# EAGLE board BMS Master Teensy V 2.22 move 4G (EAGLE 7.2.0), part 1 of 2
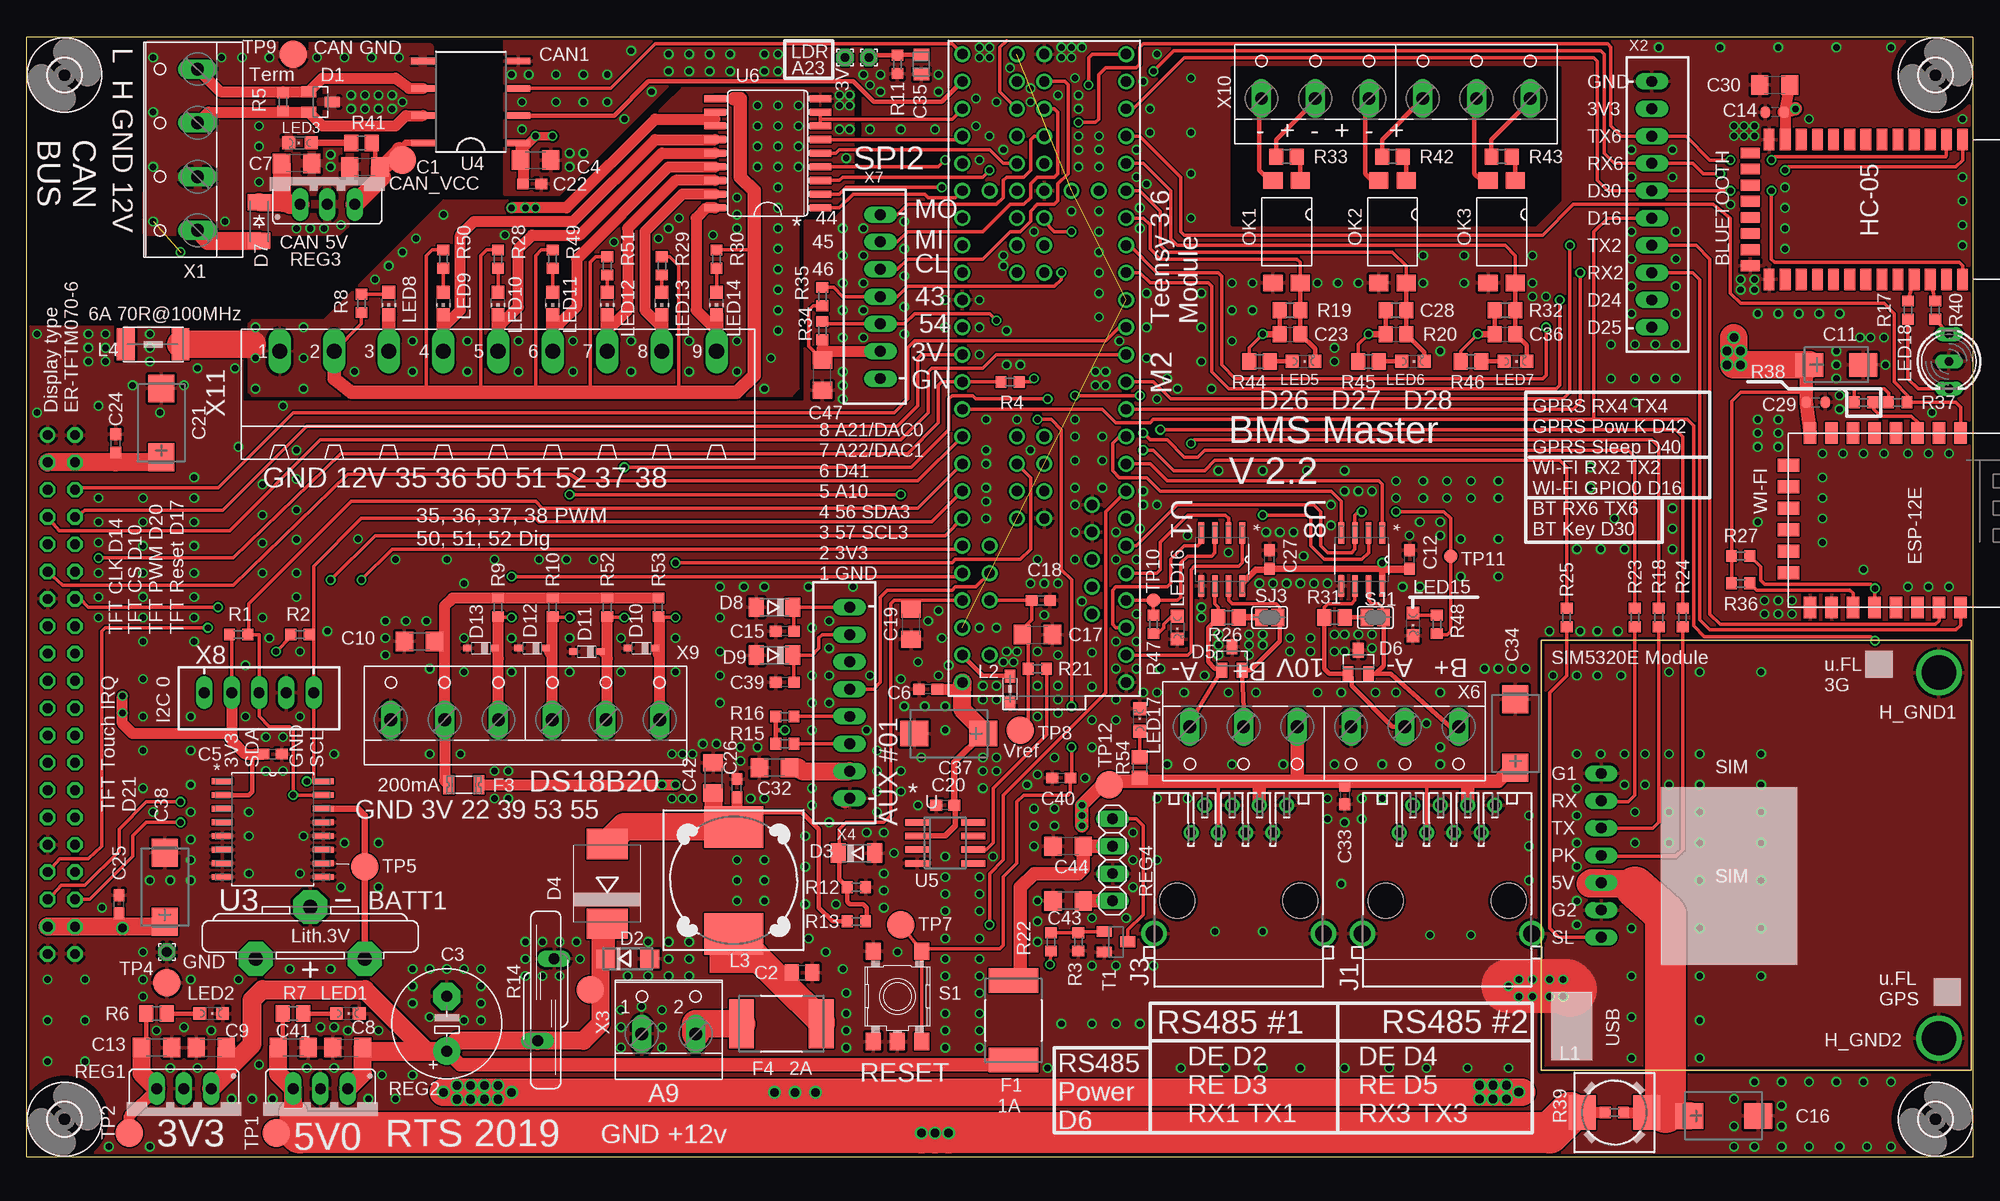
[diagram p3: board, top side]
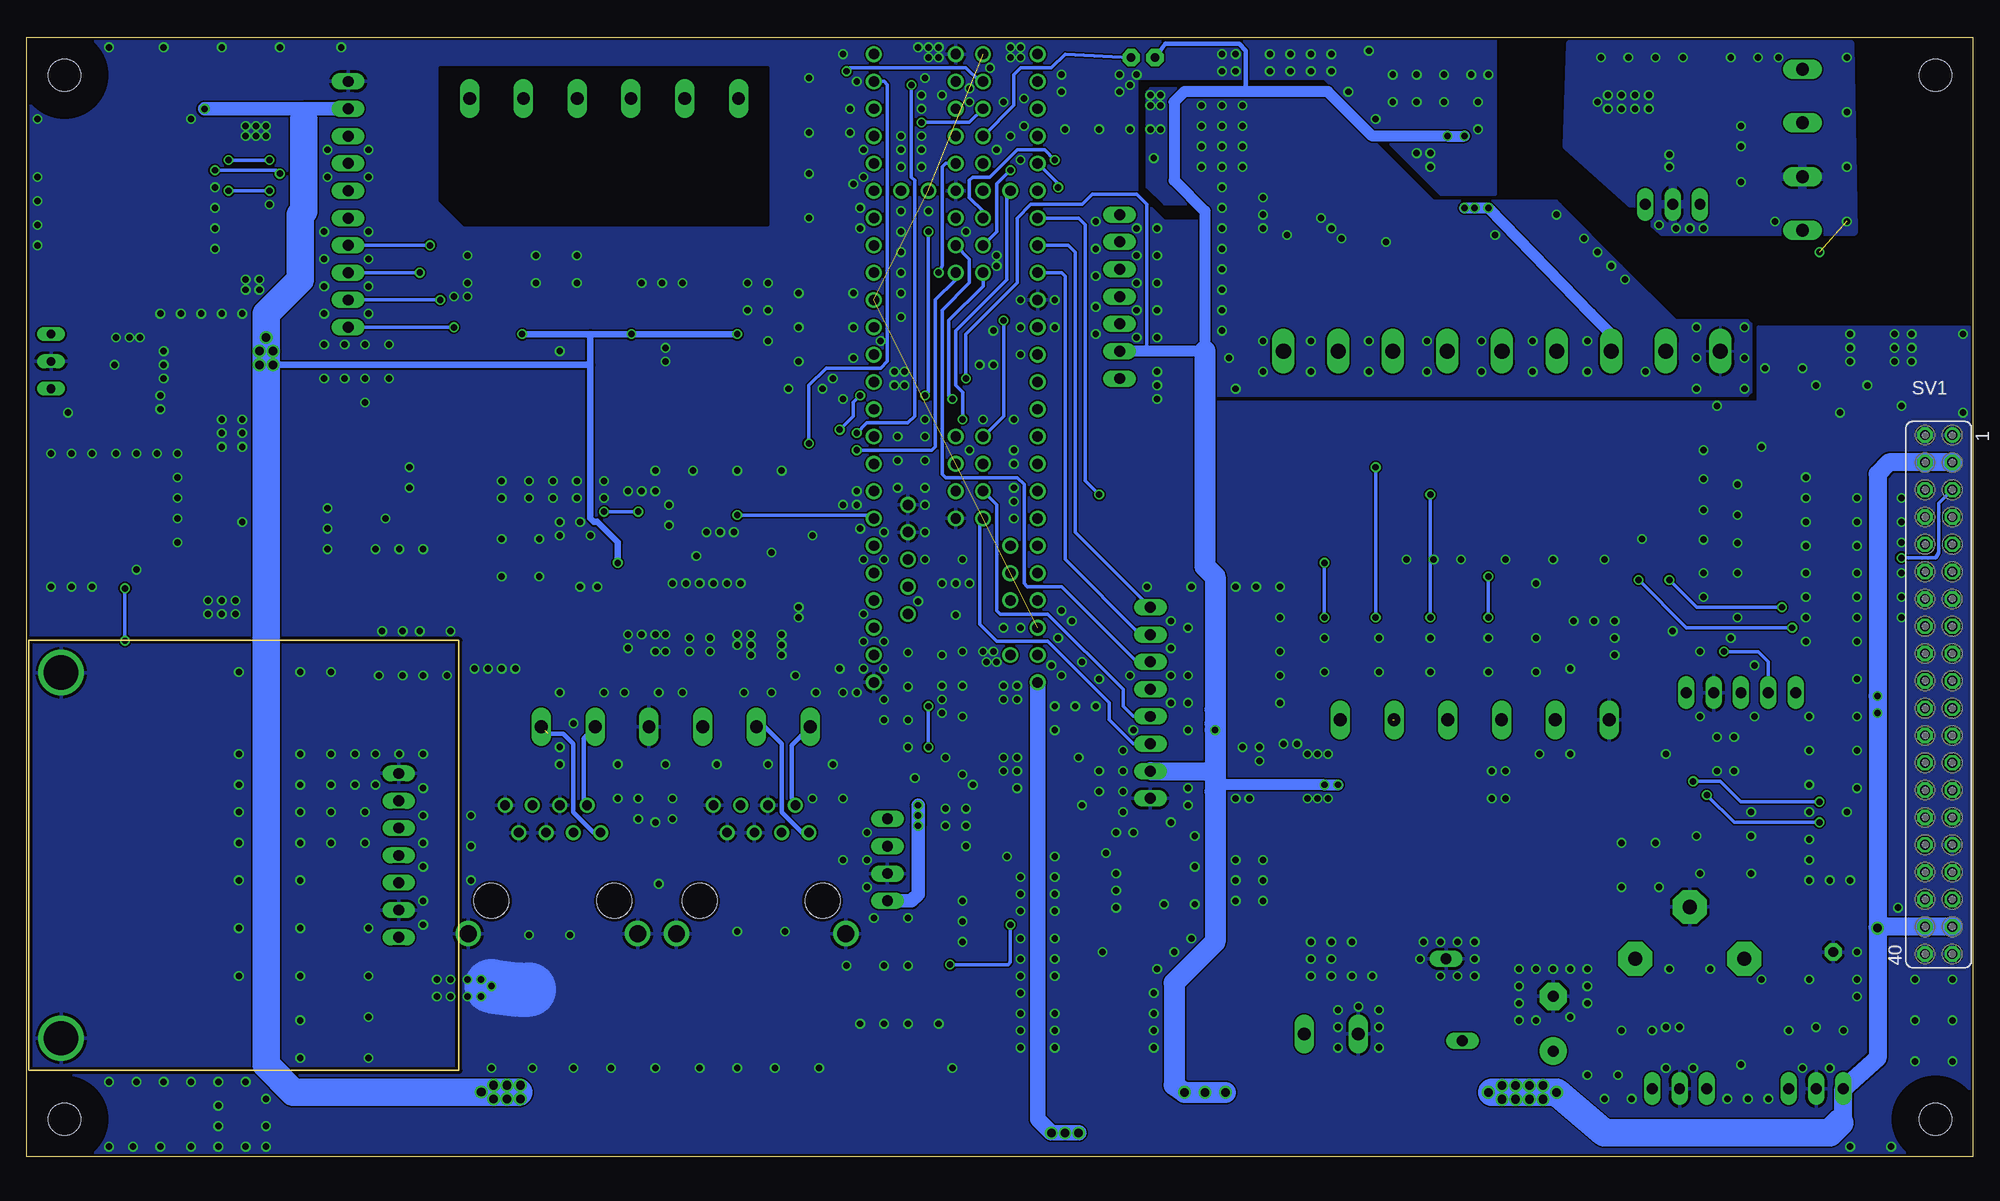
[diagram p4: board, bottom side, seen from below]

Size 181 x 104.14 mm. Coordinates in mm from the lower left corner, seen from the top.
Outline: 181,104.14 181,0 0,0 0,104.14 180.97,104.14
Copper layers (1*16): Top 0.035mm / dielectric 1.5mm / Bottom 0.035mm
Design rules "SeeedStudio_2layer_DRU_no_angle_20140221": minimum track width 6mil, minimum drill 12mil, track to track 6mil, track to pad 6mil, pad to pad 6mil, via to via 6mil, smd to smd 0mil, copper to edge 10mil, drill to drill 10mil, minimum pad ring 10mil, minimum via ring 6mil, stop-mask expansion 2mil, vias tented up to drill 100mil, thermal gap 10mil
Net classes: 1 power: width 0.152 mm, drill 0.61 mm, clearance 0.229 mm; 2 RS485 Differential: width 0.076 mm, drill 0.229 mm, clearance 0.229 mm
tRestrict: area 112.1,86.7 to 142.6,101.3
bRestrict: area 112.1,86.7 to 142.6,101.3

## Footprints (pad centres in the part's own frame; a part is rotated, then mirrored left to right if it is on the bottom)
1,6/0,8 = drill 0.813 pad 1.6 octagon: 1 0,0
CR2032V = drill 1.321 pad 3.15 octagon: + -2.54,-5.08; +@1 -2.54,5.08; - 2.286,0
BLUETOOTH_SMD = smd 2 x 1: 1 0,0; 2 0,-1.5; 3 0,-3; 4 0,-4.5; 5 0,-6; 6 0,-7.5; 7 0,-9; 8 0,-10.5; 9 0,-12; 10 0,-13.5; 11 0,-15; 12 0,-16.5; 13 0,-18; 22 13,-18; 23 13,-16.5; 24 13,-15; 25 13,-13.5; 26 13,-12; 27 13,-10.5; 28 13,-9; 29 13,-7.5; 30 13,-6; 31 13,-4.5; 32 13,-3; 33 13,-1.5; 34 13,0 | smd 1 x 1.8: 14 1.25,-19.75; 15 2.75,-19.75; 16 4.25,-19.75; 17 5.75,-19.75; 18 7.25,-19.75; 19 8.75,-19.75; 20 10.25,-19.75; 21 11.75,-19.75
C1206 = smd 1.6 x 1.8: 1 -1.4,0; 2 1.4,0
C0805 = smd 1.3 x 1.5: 1 -0.95,0; 2 0.95,0
E5-10,5 = drill 1.016 pad 2.54: + -2.54,0 | drill 1.016 pad 2.54 octagon: - 2.54,0
C0603 = smd 1.1 x 1: 1 -0.85,0; 2 0.85,0
CT6032 = smd 2.6 x 2.2: + -2.5,0; - 2.5,0
C0603-ROUND = smd 0.898 x 1.1: 1 -0.889,0; 2 0.889,0
CT7343 = smd 2.6 x 2.4: + -3.2,0; - 3.2,0
CAPC2012X140N = smd 1.118 x 1.448: 1 -0.914,0; 2 0.914,0
B2,54 = smd 2.54 x 2.54: TP 0,0
SOT23 = smd 1 x 1.4: 1 -0.95,-1.1; 2 0.95,-1.1; 3 0,1.1
DO214AC = smd 1.8 x 1.7: A 2.05,0; C -2.05,0
SOD80C = smd 1.4 x 1.8: A 1.7,0; C -1.7,0
SMC = smd 2.8 x 3.8: A 3.7,0; C -3.7,0
SOD-123_MINI-SMA = smd 1.5 x 2.1: A 1.8,0; C -1.8,0
SOD323_ST = smd 0.8 x 0.6: A 1.25,0; C -1.25,0
SMD050F = smd 2.3 x 4.6: 1 -3.7,0; 2 3.7,0
1206L = smd 1 x 1.8: 1 -1.4,0; 2 1.4,0
1,6/0,9 = drill 0.914 pad 1.6 octagon: 1 0,0
555153-1 = drill 0.889: 1 -4.445,6.35; 2 -3.175,8.89; 3 -1.905,6.35; 4 -0.635,8.89; 5 0.635,6.35; 6 1.905,8.89; 7 3.175,6.35; 8 4.445,8.89 | drill 1.575 pad 2.184: G1 -7.874,-3.048; G2 7.874,-3.048 | hole 3.251: -5.715,0; 5.715,0
DR73 = smd 2.5 x 3.25: 1 -3,0; 2 3,0
0805 = smd 1.2 x 1: 1 -1.2,0; 2 1.2,0
DR127 = smd 3.85 x 5.5: 1 -4.975,0; 2 4.975,0
1812 = smd 1.65 x 3: 1 -2.55,0; 2 2.55,0
CHIPLED_0805 = smd 1.2 x 1.2: A 0,-1.05; C 0,1.05
CHIP-LED0805 = smd 1.2 x 1.2: A 0,-1.05; C 0,1.05
DUOLED-C-5MM = drill 0.813 long: AR 2.54,0; AX -2.54,0; C 0,0
SIM5320E_MODULE = drill 1 long: GND_1 -14.4,7.62; GND_2 -14.4,-5.08; POWKEY -14.4,0; RX -14.4,5.08; SLEEP -14.4,-7.62; TX -14.4,2.54; VCC_5V -14.4,-2.54 | drill 3.2: H_GND1 17,17; H_GND2 17,-17
TEENSY_3.6_ALL_PINS&PADS = drill 0.965: 0 -7.62,26.67; 1 -7.62,24.13; 2 -7.62,21.59; 3 -7.62,19.05; 3.3V 7.62,24.13; 3.3V2 2.54,-29.21; 3.3V3 -7.62,-6.35; 3.3V4 -2.54,-16.51; 4 -7.62,16.51; 5 -7.62,13.97; 6 -7.62,11.43; 7 -7.62,8.89; 8 -7.62,6.35; 9 -7.62,3.81; 10 -7.62,1.27; 11 -7.62,-1.27; 12 -7.62,-3.81; 13 7.62,-3.81; 14/A0 7.62,-1.27; 15/A1 7.62,1.27; 16/A2 7.62,3.81; 17/A3 7.62,6.35; 18/A4 7.62,8.89; 19/A5 7.62,11.43; 20/A6 7.62,13.97; 21/A7 7.62,16.51; 22/A8 7.62,19.05; 23/A9 7.62,21.59; 24 -7.62,-8.89; 25 -7.62,-11.43; 26 -7.62,-13.97; 27 -7.62,-16.51; 28 -7.62,-19.05; 29 -7.62,-21.59; 30 -7.62,-24.13; 31/A12 -7.62,-26.67; 32/A13 -7.62,-29.21; 33/A14 7.62,-29.21; 34/A15 7.62,-26.67; 35/A16 7.62,-24.13; 36/A17 7.62,-21.59; 37/A18 7.62,-19.05; 38/A19 7.62,-16.51; 39/A20 7.62,-13.97; 40 0,-8.89; 41 0,-11.43; 42 0,-13.97; 43 0,-19.05; 44 0,-21.59; 45 0,-24.13; 46 0,-26.67; 47 2.54,-26.67; 48 2.54,-24.13; 49 2.54,-21.59; 50 2.54,-19.05; 51 2.54,-13.97; 52 2.54,-11.43; 53 2.54,-8.89; 54 2.54,6.35; 55 2.54,8.89; 56 2.54,11.43; 57 2.54,13.97; A10 5.08,19.05; A11 5.08,16.51; A21 7.62,-11.43; A22 7.62,-8.89; AGND 7.62,26.67; AREF 5.08,21.59; D+ -4.445,17.78; D- -4.445,20.32; DC 0,8.89; DE 0,11.43; DO 0,6.35; GND -7.62,29.21; GND1 7.62,-6.35; GND2 0,13.97; GND3 -4.445,15.24; GND4 -4.445,12.7; GND5 0,-29.21; GND6 0,-16.51; PGM 2.54,-16.51; RESET 5.08,-16.51; VBAT -5.08,-16.51; VIN 7.62,29.21; VUSB 5.08,26.67; VUSB1 -4.445,22.86
SMD4-7 = smd 1.78 x 1.55: 1 -1.27,-4.77; 2 1.27,-4.77; 3 1.27,4.77; 4 -1.27,4.77
R0603 = smd 1 x 1.1: 1 -0.85,0; 2 0.85,0
R0805 = smd 1.3 x 1.5: 1 -0.95,0; 2 0.95,0
S14K11 = drill 1.016 long: 1 -0.762,-3.81; 2 0.762,3.81
78XXS = drill 1.016 long: GND 0,-2.54; IN -2.54,-2.54; OUT 2.54,-2.54
1X04 = drill 1.016 long: 1 -3.81,0; 2 -1.27,0; 3 1.27,0; 4 3.81,0
SKHMPXE010 = smd 1.6 x 1.4: 1 -4.2,2.25; 2 4.2,2.25; 3 -4.2,-2.25; 4 4.2,-2.25; 5 4.2,0
SJ = smd 1.168 x 1.6: 1 -0.762,0; 2 0.762,0
FE20-2 = drill 0.914: 1 -24.13,1.27 | drill 0.914 octagon: 2 -24.13,-1.27; 3 -21.59,1.27; 4 -21.59,-1.27; 5 -19.05,1.27; 6 -19.05,-1.27; 7 -16.51,1.27; 8 -16.51,-1.27; 9 -13.97,1.27; 10 -13.97,-1.27; 11 -11.43,1.27; 12 -11.43,-1.27; 13 -8.89,1.27; 14 -8.89,-1.27; 15 -6.35,1.27; 16 -6.35,-1.27; 17 -3.81,1.27; 18 -3.81,-1.27; 19 -1.27,1.27; 20 -1.27,-1.27; 21 1.27,1.27; 22 1.27,-1.27; 23 3.81,1.27; 24 3.81,-1.27; 25 6.35,1.27; 26 6.35,-1.27; 27 8.89,1.27; 28 8.89,-1.27; 29 11.43,1.27; 30 11.43,-1.27; 31 13.97,1.27; 32 13.97,-1.27; 33 16.51,1.27; 34 16.51,-1.27; 35 19.05,1.27; 36 19.05,-1.27; 37 21.59,1.27; 38 21.59,-1.27; 39 24.13,1.27; 40 24.13,-1.27
B1,27 = smd 1.27 x 1.27: TP 0,0
SOIC127P600X175-8N = smd 1.981 x 0.533: 1 -2.464,1.905; 2 -2.464,0.635; 3 -2.464,-0.635; 4 -2.464,-1.905; 5 2.464,-1.905; 6 2.464,-0.635; 7 2.464,0.635; 8 2.464,1.905
SOIC127P1032X265-16N = smd 1.981 x 0.533: 1 -4.699,4.445; 2 -4.699,3.175; 3 -4.699,1.905; 4 -4.699,0.635; 5 -4.699,-0.635; 6 -4.699,-1.905; 7 -4.699,-3.175; 8 -4.699,-4.445; 9 4.699,-4.445; 10 4.699,-3.175; 11 4.699,-1.905; 12 4.699,-0.635; 13 4.699,0.635; 14 4.699,1.905; 15 4.699,3.175; 16 4.699,4.445
DUB-R-PDSO-G8 = smd 0.6 x 2.2: 1 -3.81,-4.445; 2 -1.27,-4.445; 3 1.27,-4.445; 4 3.81,-4.445; 5 3.81,4.445; 6 1.27,4.445; 7 -1.27,4.445; 8 -3.81,4.445
MAX6177AASA+ = smd 0.6 x 2.2: 1 -1.905,-2.6; 2 -0.635,-2.6; 3 0.635,-2.6; 4 1.905,-2.6; 5 1.905,2.6; 6 0.635,2.6; 7 -0.635,2.6; 8 -1.905,2.6
SO18L = smd 0.66 x 2.032: 1 -5.08,-4.902; 2 -3.81,-4.902; 3 -2.54,-4.902; 4 -1.27,-4.902; 5 0,-4.902; 6 1.27,-4.902; 7 2.54,-4.902; 8 3.81,-4.902; 9 5.08,-4.902; 10 5.08,4.902; 11 3.81,4.902; 12 2.54,4.902; 13 1.27,4.902; 14 0,4.902; 15 -1.27,4.902; 16 -2.54,4.902; 17 -3.81,4.902; 18 -5.08,4.902
3,0 = hole 3: 0,0
ESP8266-ESP12E = smd 2 x 1.2: 1 -7.62,5.84; 2 -7.62,3.84; 3 -7.62,1.84; 4 -7.62,-0.16; 5 -7.62,-2.16; 6 -7.62,-4.16; 7 -7.62,-6.16; 8 -7.62,-8.16; 9 8.58,-8.16; 10 8.58,-6.16; 11 8.58,-4.16; 12 8.58,-2.16; 13 8.58,-0.16; 14 8.58,1.84; 15 8.58,3.84; 16 8.58,5.84 | smd 1.2 x 2: 17 -4.62,-10.16; 18 -2.62,-10.16; 19 -0.62,-10.16; 20 1.38,-10.16; 21 3.38,-10.16; 22 5.38,-10.16
W237-4 = drill 1.194 long: 1 -7.5,-1.27; 2 -2.5,-1.27; 3 2.5,-1.27; 4 7.5,-1.27
JST-XH-10-PACKAGE-LONG-PAD = drill 1.016 long: 1 -11.43,0; 2 -8.89,0; 3 -6.35,0; 4 -3.81,0; 5 -1.27,0; 6 1.27,0; 7 3.81,0; 8 6.35,0; 9 8.89,0; 10 11.43,0
W237-102 = drill 1.194 long: 1 -2.5,-1.27; 2 2.5,-1.27
JST-XH-08-PACKAGE-LONG-PAD = drill 1.016 long: 1 -8.89,0; 2 -6.35,0; 3 -3.81,0; 4 -1.27,0; 5 1.27,0; 6 3.81,0; 7 6.35,0; 8 8.89,0
W237-6 = drill 1.194 long: 1 -12.5,-1.27; 2 -7.5,-1.27; 3 -2.5,-1.27; 4 2.5,-1.27; 5 7.5,-1.27; 6 12.5,-1.27
JST-XH-07-PACKAGE-LONG-PAD = drill 1.016 long: 1 -7.62,0; 2 -5.08,0; 3 -2.54,0; 4 0,0; 5 2.54,0; 6 5.08,0; 7 7.62,0
JST-XH-05-PACKAGE-LONG-PAD = drill 1.016 long: 1 -5.08,0; 2 -2.54,0; 3 0,0; 4 2.54,0; 5 5.08,0
MSTBA9 = drill 1.397 long: 1 -20.32,5.08; 2 -15.24,5.08; 3 -10.16,5.08; 4 -5.08,5.08; 5 0,5.08; 6 5.08,5.08; 7 10.16,5.08; 8 15.24,5.08; 9 20.32,5.08

## Placement (x,y rotation side)
3V  [1,6/0,8]  76.08,102.23 0 top
BATT1  CR2032V  [CR2032V]  26.35,20.95 90 top
BLUETOOTH  HC_05  [BLUETOOTH_SMD]  180.02,94.61 270 top
C1  10uF  [C1206]  31.43,92.08 0 top
C2  100nF 25V  [C0805]  72.07,17.14 0 top
C3  2200uF 25V  [E5-10,5]  39.05,12.38 90 top
C4  10uF 6V3  [C1206]  47.31,92.71 0 top
C5  100nF  [C0603]  22.86,37.47 0 top
C6  100nF  [C0603]  83.82,43.5 180 top
C7  10uF  [C1206]  25.08,92.39 180 top
C8  10uF 25v  [C1206]  29.84,10.16 0 top
C9  10uF 25v  [C1206]  17.14,10.16 0 top
C10  10uF  [C1206]  36.51,47.94 0 top
C11  100uF 6V3  [CT6032]  168.28,73.66 0 top
C12  100nF  [C0603]  128.59,55.56 90 top
C13  10uF 25v  [C1206]  12.06,10.16 180 top
C14  100n  [C0603-ROUND]  162.56,97.16 180 top
C15  100nF  [C0603]  70.48,48.9 180 top
C16  470uF 6v3  [CT7343]  157.8,3.81 0 top
C17  10uF 6V3  [C1206]  93.98,48.58 0 top
C18  100nF  [C0603]  94.3,51.75 0 top
C19  47uF 6V3  [C1206]  82.23,49.53 90 top
C20  100nF  [C0603]  85.41,32.7 180 top
C21  220uF 6v3  [CT7343]  12.5,68.26 90 top
C22  100nF  [C0603]  46.99,90.49 0 top
C23  100nF  [C0805]  117.47,76.52 0 top
C24  100nF  [C0603]  8.26,66.36 90 top
C25  100nF  [C0603]  8.57,23.5 90 top
C26  100nF 25v  [C0603]  66.04,34.29 90 top
C27  100nF  [C0603]  115.57,55.56 90 top
C28  100nF  [C0805]  127.32,76.52 0 top
C29  100n  [C0603-ROUND]  166.37,70.17 0 top
C30  10uF  [C1206]  162.56,99.69 0 top
C32  10uF 6V3  [C1206]  69.53,36.2 180 top
C33  100nF  [C0603]  122.56,33.66 270 top
C34  220uF 16V  [CT7343]  138.43,39.37 90 top
C35  10µF  [CAPC2012X140N]  83.19,101.6 90 top
C36  100nF  [C0805]  137.48,76.52 0 top
C37  220uF 6v3  [CT7343]  85.72,39.37 180 top
C38  220uF 6v3  [CT7343]  12.82,25.08 90 top
C39  100nF  [C0603]  70.48,44.13 180 top
C40  100pF NM  [C0603]  96.2,35.24 0 top
C41  10uF 25v  [C1206]  24.77,10.16 180 top
C42  10uF  [C1206]  63.82,35.24 270 top
C43  10uF 6V3  [C1206]  96.84,23.81 180 top
C44  10uF 6V3  [C1206]  96.84,28.89 180 top
C47  10uF  [C1206]  73.98,72.71 90 top
CAN_VCC  TPB2,54  [B2,54]  34.92,92.71 0 top
D1  PESD1CAN  [SOT23]  27.3,98.11 270 top
D2  SMBJ14A  [DO214AC]  55.88,18.41 0 top
D3  3V3  [SOD80C]  77.15,28.26 0 top
D4  [SMC]  53.98,25.4 90 top
D5  PESD1CAN  [SOT23]  112.08,46.35 0 top
D6  PESD1CAN  [SOT23]  123.83,46.04 0 top
D7  CGRM4001-G  [SOD-123_MINI-SMA]  21.59,87 270 top
D8  3V3  [SOD80C]  69.53,51.12 180 top
D9  3V3  [SOD80C]  69.53,46.67 180 top
D10  SOD-323_ZENER_DIODE  [SOD323_ST]  57.15,47.31 180 top
D11  SOD-323_ZENER_DIODE  [SOD323_ST]  52.07,46.99 180 top
D12  SOD-323_ZENER_DIODE  [SOD323_ST]  46.99,47.31 180 top
D13  SOD-323_ZENER_DIODE  [SOD323_ST]  42.23,47.31 180 top
F1  SMD100F  [SMD050F]  91.76,12.7 90 top
F3  1206L075TH  [1206L]  40.64,34.61 180 top
F4  SMD100F  [SMD050F]  70.17,12.38 0 top
GND  [1,6/0,9]  13.02,19.05 0 top
J1  [555153-1]  132.08,23.81 0 top
J3  [555153-1]  112.71,23.81 0 top
L1  DR73  [DR73]  147.64,4.13 180 top
L2  [0805]  91.44,43.5 270 top
L3  DR127  [DR127]  65.72,25.72 90 top
L4  [1812]  11.75,75.56 180 top
LDR  [1,6/0,8]  78.31,102.23 0 top
LED1  Green  [CHIPLED_0805]  29.84,13.34 270 top
LED2  Green  [CHIPLED_0805]  17.14,13.34 270 top
LED3  Green  [CHIPLED_0805]  25.4,94.3 90 top
LED5  Blue  [CHIPLED_0805]  118.75,73.98 270 top
LED6  Blue  [CHIPLED_0805]  128.91,73.98 270 top
LED7  Blue  [CHIPLED_0805]  138.43,73.98 270 top
LED8  Red  [CHIP-LED0805]  33.66,79.38 180 top
LED9  RED  [CHIP-LED0805]  38.73,79.38 180 top
LED10  WHITE  [CHIP-LED0805]  43.81,79.38 180 top
LED11  YELLOW  [CHIP-LED0805]  48.9,79.38 180 top
LED12  GREEN  [CHIP-LED0805]  53.98,79.38 180 top
LED13  BLUE  [CHIP-LED0805]  59.05,79.38 180 top
LED14  WHITE  [CHIP-LED0805]  64.14,79.38 180 top
LED15  Yellow  [CHIPLED_0805]  128.91,49.53 180 top
LED16  Yellow  [CHIPLED_0805]  107,49.21 180 top
LED17  Green  [CHIPLED_0805]  103.5,40.64 0 top
LED18  [DUOLED-C-5MM]  178.75,73.98 270 top
M1  [SIM5320E_MODULE]  160.82,28.04 0 top
M2  TEENSY_3.6_ALL_PINS&PADS  [TEENSY_3.6_ALL_PINS&PADS]  94.61,73.34 180 top
OK1  SFH6186-2  [SMD4-7]  117.16,86.04 180 top
OK2  SFH6186-2  [SMD4-7]  127,86.04 180 top
OK3  SFH6186-2  [SMD4-7]  137.16,86.04 180 top
R1  3K3  [R0603]  19.68,48.58 180 top
R2  3K3  [R0603]  25.4,48.58 180 top
R3  1M  [R0603]  97.79,20 270 top
R4  10K  [R0603]  91.44,72.07 0 top
R5  120R -OPTIONAL  [R0603]  23.81,98.11 90 top
R6  10K  [R0805]  12.06,13.34 180 top
R7  22K  [R0805]  24.77,13.34 180 top
R8  22K  [R0603]  31.11,79.38 90 top
R9  2K2  [R0603]  43.81,51.12 90 top
R10  2K2  [R0603]  48.9,51.12 90 top
R11  10K  [R0603]  80.96,101.6 270 top
R12  2K2  [R0603]  77.15,25.08 180 top
R13  10K  [R0603]  77.15,21.91 180 top
R14  S14K11  [S14K11]  48.26,14.61 180 top
R15  3K3  [R0603]  70.48,38.42 180 top
R16  3K3  [R0603]  70.48,40.96 180 top
R17  1K  [R0603]  174.94,78.74 90 top
R18  1K  [R0603]  151.76,50.16 270 top
R19  10K  [R0805]  117.47,78.74 180 top
R20  10K  [R0805]  127.32,78.74 180 top
R21  470R  [R0603]  93.98,45.4 0 top
R22  10K  [R0603]  95.25,20 90 top
R23  1K  [R0603]  149.54,50.16 270 top
R24  1K  [R0603]  153.99,50.16 270 top
R25  1K  [R0603]  143.19,50.16 90 top
R26  100R  [R0805]  111.76,50.16 180 top
R27  4K7  [R0603]  159.38,53.34 0 top
R28  22K  [R0603]  43.81,83.5 270 top
R29  22K  [R0603]  59.05,82.87 270 top
R30  22K  [R0603]  64.14,83.5 270 top
R31  100R  [R0805]  121.6,50.16 180 top
R32  10K  [R0805]  137.48,78.74 180 top
R33  2K2  [R0805]  117.16,93.03 180 top
R34  10K  [R0603]  73.98,76.83 270 top
R35  10K  [R0603]  73.98,80.01 270 top
R36  4K7  [R0603]  159.38,55.88 0 top
R37  4K7  [R0603]  173.99,70.17 180 top
R38  4K7  [R0603]  170.81,70.17 180 top
R39  0R  [R0603]  147.64,4.13 180 top
R40  1K  [R0603]  177.48,78.74 90 top
R41  22K  [R0805]  31.11,94.3 0 top
R42  2k2  [R0805]  127,93.03 180 top
R43  2K2  [R0805]  137.16,93.03 180 top
R44  10K  [R0805]  114.62,73.98 180 top
R45  10K  [R0805]  124.78,73.98 180 top
R46  10K  [R0805]  134.3,73.98 180 top
R47  10K  [R0603]  104.78,49.53 90 top
R48  10K  [R0603]  131.13,49.53 270 top
R49  22K  [R0603]  48.9,83.5 270 top
R50  22K  [R0603]  38.73,83.5 270 top
R51  22K  [R0603]  53.98,82.87 270 top
R52  2K2  [R0603]  53.98,51.12 90 top
R53  2K2  [R0603]  58.74,51.12 90 top
R54  33K  [R0805]  103.5,36.2 270 top
REG1  7833  [78XXS]  14.61,3.81 180 top
REG2  7805  [78XXS]  27.3,3.81 180 top
REG3  7805  [78XXS]  27.94,91.12 0 top
REG4  [1X04]  100.97,27.62 270 top
S1  SKHMPWE010  [SKHMPXE010]  80.96,14.92 270 top
SJ1  [SJ]  125.41,50.16 180 top
SJ3  [SJ]  115.57,50.16 180 top
SV1  [FE20-2]  3.2,43 270 bottom
T1  BC846  [SOT23]  101.28,20 270 top
TP1  TPB2,54  [B2,54]  23.18,2.22 0 top
TP2  TPB2,54  [B2,54]  9.53,2.22 0 top
TP3  TPB2,54  [B2,54]  52.39,15.56 0 top
TP4  TPB2,54  [B2,54]  13.02,16.19 0 top
TP5  TPB2,54  [B2,54]  31.43,26.99 0 top
TP7  TPB2,54  [B2,54]  81.28,21.59 0 top
TP8  TPB2,54  [B2,54]  92.39,39.69 0 top
TP9  TPB2,54  [B2,54]  24.77,102.55 0 top
TP10  TPB1,27  [B1,27]  104.78,51.75 0 top
TP11  TPB1,27  [B1,27]  132.4,55.88 0 top
TP12  TPB2,54  [B2,54]  100.65,34.61 0 top
U1  MAX485CSA+  [SOIC127P600X175-8N]  111.12,55.56 270 top
U3  DS3231S  [SOIC127P1032X265-16N]  22.86,30.48 0 top
U4  ISO1050DUB  [DUB-R-PDSO-G8]  41.27,98.11 90 top
U5  U5  [MAX6177AASA+]  85.41,29.21 270 top
U6  ULN2803  [SO18L]  68.9,93.34 90 top
U8  MAX485CSA+  [SOIC127P600X175-8N]  124.14,55.56 270 top
U$2  [3,0]  3.5,3.5 0 top
U$4  [3,0]  3.5,100.6 0 top
U$6  [3,0]  177.5,100.6 0 top
U$7  [3,0]  177.5,3.5 0 top
WI-FI  [ESP8266-ESP12E]  173.99,59.69 270 top
X1  [W237-4]  14.61,93.66 90 top
X2  JST-XH-10-PIN-LONG-PAD  [JST-XH-10-PACKAGE-LONG-PAD]  151.13,88.58 270 top
X3  [W237-102]  59.69,12.7 0 top
X4  JST-XH-08-PIN-LONG-PAD  [JST-XH-08-PACKAGE-LONG-PAD]  76.52,42.23 90 top
X6  [W237-6]  120.65,38.73 180 top
X7  JST-XH-07-PIN-LONG-PAD  [JST-XH-07-PACKAGE-LONG-PAD]  79.38,80.01 90 top
X8  JST-XH-05-PIN-LONG-PAD  [JST-XH-05-PACKAGE-LONG-PAD]  21.59,43.18 180 top
X9  [W237-6]  46.35,41.91 0 top
X10  [W237-6]  127.32,99.69 0 top
X11  MSTBA9  [MSTBA9]  43.81,69.85 0 top